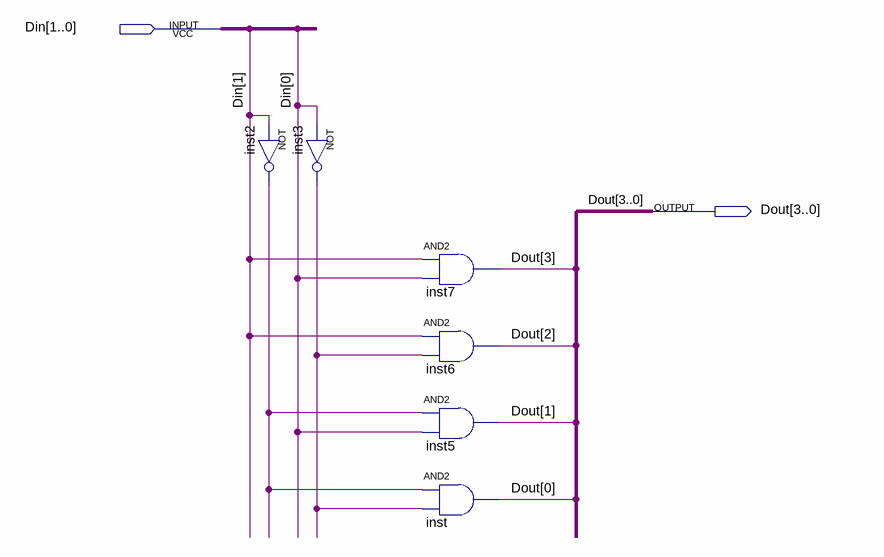
[diagram p0: schematic sheet]
// Quartus schematic OneHotEncoder2.bdf as structural Verilog: 6 symbols, 2 pins
module OneHotEncoder2 (
  input  [1:0] Din,
  output [3:0] Dout
);

  wire inst2_out, inst3_out;

  not inst2 (inst2_out, Din[1]);
  not inst3 (inst3_out, Din[0]);
  and inst7 (Dout[3], Din[1], Din[0]);
  and inst6 (Dout[2], Din[1], inst3_out);
  and inst5 (Dout[1], inst2_out, Din[0]);
  and inst (Dout[0], inst2_out, inst3_out);
endmodule
